# Altium schematic sheet Seeeduino and Temp.SchDoc
size A4; DocumentNumber: 2; SheetNumber: 2; SheetTotal: 11
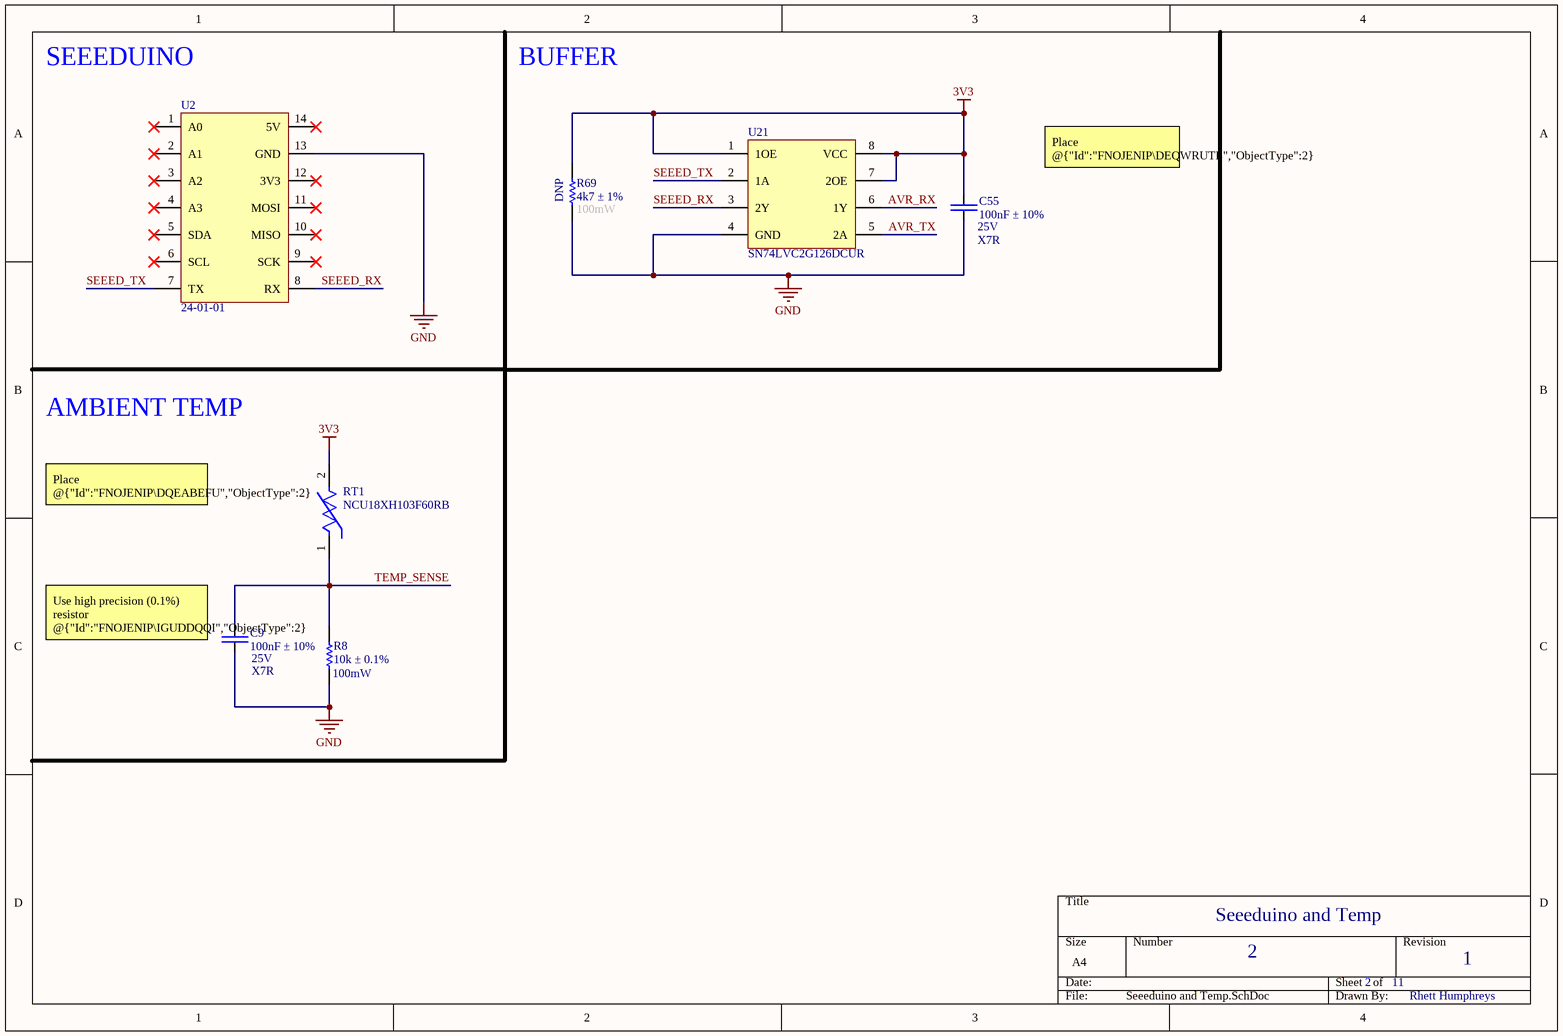
[diagram p0: Seeeduino and Temp.SchDoc]

## Parts
C9  100nF ± 10%  [CAP-0603]
C55  100nF ± 10%  [CAP-0603]
R8  10k ± 0.1%  [RES-0603]
R69  4k7 ± 1%  [RES-0603]
RT1  NCU18XH103F60RB  [FP-NCU18-0_15-MFG]
U2  24-01-01  [SEEEDUINO XIAO]
U21  SN74LVC2G126DCUR  [TSSOP50P310X90-8N]

## Nets
3V3: C55.2 R69.1 RT1.2 U21.1(1OE) U21.7(2OE) U21.8(VCC)
GND: C9.1 C55.1 R8.2 R69.2 U2.13(GND) U21.4(GND)
AVR_RX: U21.6(1Y)
AVR_TX: U21.5(2A)
SEEED_RX: U2.8(RX) U21.3(2Y)
SEEED_TX: U2.7(TX) U21.2(1A)
TEMP_SENSE: C9.2 R8.1 RT1.1

Not connected (* = marked no-connect by the designer): U2 1(A0)* 2(A1)* 3(A2)* 4(A3)* 5(SDA)* 6(SCL)* 9(SCK)* 10(MISO)* 11(MOSI)* 12(3V3)* 14(5V)*

## Notes on the sheet
- SEEEDUINO
- BUFFER
- Place @{"Id":"FNOJENIP\DEQWRUTL","ObjectType":2} as close as possible to @{"Id":"FNOJENIP\KYCZRSMO","ObjectType":2}
- (near R69) DNP
- (near R69) 100mW
- (near C55) X7R
- (near C55) 25V
- AMBIENT TEMP
- Place @{"Id":"FNOJENIP\DQEABEFU","ObjectType":2} as close as possible to @{"Id":"YEMLWZAK\HIGJTEGZ","ObjectType":2}
- (near C9) Use high precision (0.1%) resistor @{"Id":"FNOJENIP\IGUDDQQI","ObjectType":2} to form divider with @{"Id":"FNOJENIP\MLOTZGQT","ObjectType":2}
- (near C9) X7R
- (near C9) 25V
- (near R8) 100mW
- Seeeduino and Temp
- 2
- 11
- 1
- Rhett Humphreys

## Library data of the parts
C9 C55 = CAP-0603: Capacitor chip unpolarized. 0603
R8 R69 = RES-0603: Resistor chip. 0603
RT1 = CMP-06022-000443-2: THERMISTOR NTC; Max Operating Temperature: 125°C; REACH SVHC: No SVHC; Case/Package: 0603; Min Operating Temperature: -40°C; RoHS Compliant: Yes; Case Code (Imperial): 0603; Case Code (Metric): 1608
U2 = SEEDUINO XIAO